# EAGLE design PressureSensorSingle (EAGLE 8.5.2)
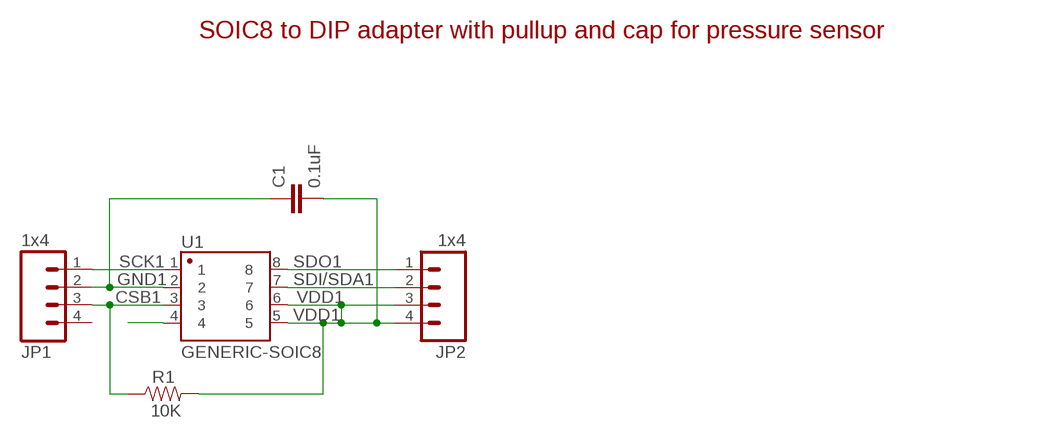
[diagram p0: schematic, sheet 1]

## Parts
C1  0.1uF  0.1UF-0603-25V-5%  [0603]
JP1  1x4  M041X04_NO_SILK  [1X04_NO_SILK]
JP2  1x4  M04NO_SILK_ALL_ROUND  [1X04_NO_SILK_ALL_ROUND]
R1  10K  RESISTOR0603  [0603]
U1  GENERIC-SOIC8  [SO08-UNIVERSAL]

## Nets
CSB1: JP1.3 R1.1 U1.3
GND1: C1.1 JP1.2 U1.2
NC1: U1.4
SCK1: JP1.1 U1.1
SDI/SDA1: JP2.2 U1.7
SDO1: JP2.1 U1.8
VDD1: C1.2 JP2.3 JP2.4 R1.2 U1.5 U1.6
Unconnected: JP1.4

## Notes on the sheet
- SOIC8 to DIP adapter with pullup and cap for pressure sensor

## Library data of the parts
C1 = SparkFun-Capacitors:0.1UF: 0.1µF ceramic capacitors A capacitor is a passive two-terminal electrical component used to store electrical energy temporarily in an electric field.; PROD_ID: CAP-08604
JP1 JP2 = SparkFun-Connectors:M04: Header 4 Standard 4-pin 0.1" header. Use with straight break away headers (SKU : PRT-00116), right angle break away headers (PRT-00553), swiss pins (PRT-00743), machine pins (PRT-00117), and female headers (PRT-00115). Molex polarized connector foot print use with SKU : PRT-08231 with associated crimp pins and housings. 1MM SMD Version SKU: PRT-10208
R1 = SparkFun-Resistors:RESISTOR: Generic Resistor Package
U1 = SparkFun-AnalogIC:GENERIC-SOIC8: A placeholder for generic narrow & wide SOIC8 foorptints - used on the DIP adapter board.

## Board
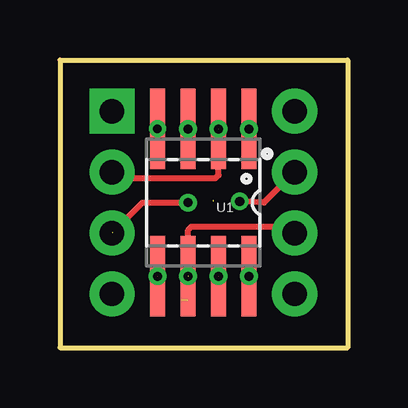
[diagram p1: board, top side]
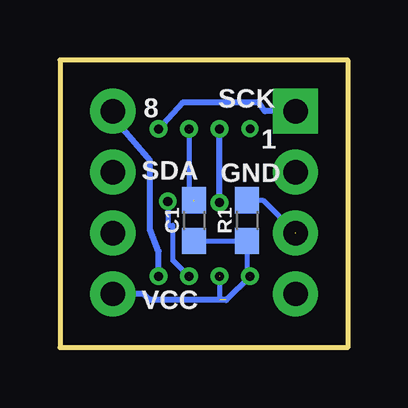
[diagram p2: board, bottom side, seen from below]

Size 12 x 12 mm. Coordinates in mm from the lower left corner, seen from the top.
Outline: 0,12 0,0 12,0 12,12 0,12
Copper layers (1*16): Top 0.0356mm / dielectric 1.5011mm / Bottom 0.0356mm
Design rules "Oshpark_mm": minimum track width 0.15mm, minimum drill 0.33mm, track to track 0.15mm, track to pad 0.15mm, pad to pad 0.15mm, via to via 0.15mm, smd to smd 0.15mm, copper to edge 0.38mm, drill to drill 0.15mm, minimum pad ring 7mil, minimum via ring 7mil, stop-mask expansion 3mil, vias tented up to drill 0mil, thermal gap 10mil

### Footprints (pad centres in the part's own frame; a part is rotated, then mirrored left to right if it is on the bottom)
0603 = smd 1.1 x 1: 1 -0.85,0; 2 0.85,0
1X04_NO_SILK = drill 1.016 pad 1.88 square: 1 0,0 | drill 1.016 pad 1.88: 2 2.54,0; 3 5.08,0; 4 7.62,0
1X04_NO_SILK_ALL_ROUND = drill 1.016 pad 1.88: 1 0,0; 2 2.54,0; 3 5.08,0; 4 7.62,0
SO08-UNIVERSAL = smd 0.61 x 3.353: 1 -1.905,-3.073; 2 -0.635,-3.073; 3 0.635,-3.073; 4 1.905,-3.073; 5 1.905,3.073; 6 0.635,3.073; 7 -0.635,3.073; 8 -1.905,3.073

### Placement (x,y rotation side)
C1  6.4,5.3 270 bottom
JP1  2.17,9.86 270 top
JP2  9.79,9.86 270 top
R1  4.2,5.3 270 bottom
U1  5.98,6.05 180 top

### Tracks (layer width: path | path; a pad name or v marks a point on that pad's centre or on a via)
CSB1  (via drill 0.38)  (1 unrouted)
  Top 0.254: JP1.3 3.44,6.05 v5.34,6.05
  Bottom 0.2: R1.1 3.54,6.15 2.19,4.8
  Bottom 0.254: v5.34,6.05 v5.34,9.12
GND1  (via drill 0.38)  (2 unrouted)
  Top 0.254: JP1.2 2.42,7.06 6.49,7.06 6.62,7.19 U1.2
  Bottom 0.2: U1.2 6.61,6.31 6.4,6.1
  other vias: 6.62,9.12
N$1  (via drill 0.35)
  other vias: 4.07,9.13
SCK1  (via drill 0.38)
  Bottom 0.254: v7.88,9.12 6.89,10.21 3.69,10.21 3.44,9.86 JP1.1
SDI/SDA1  (via drill 0.38)  (1 unrouted)
  Top 0.254: v7.5,6.1 8.52,6.05 JP2.2
  Bottom 0.2: v7.5,6.1 7.5,5.1 7.3,5.1 7.3,3.65 U1.7
  other vias: 6.62,2.97
SDO1  (via drill 0.38)
  Top 0.254: v7.88,2.98 7.88,2.37 8.01,2.24
  Bottom 0.254: JP2.1 9.79,9.6 8.24,7.8 8.24,4.93 7.88,4.02 v7.88,2.98
VDD1  (via drill 0.38)  (3 unrouted)
  Top 0.254: v5.34,2.98 5.34,4.91 5.47,5.03 9.54,5.03 JP2.3
  Bottom 0.2: C1.2 R1.2 4.2,3.1 U1.5 | v5.34,2.98 5.34,1.99
  Bottom 0.254: JP2.4 8.52,2.24 8.27,1.98 5.07,1.98 U1.5
  other vias: 4.08,2.97

### Text on the board
bPlace: SCK | 8 | 1 | GND | SDA | VCC